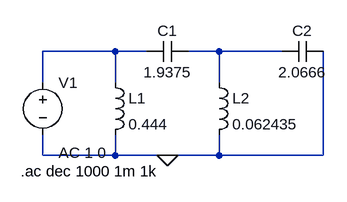
[diagram p0: schematic ej1_c.asc]
ej1_c.asc, the LTspice schematic file:
Version 4
SHEET 1 880 680
WIRE 128 64 16 64
WIRE 176 64 128 64
WIRE 288 64 240 64
WIRE 384 64 288 64
WIRE 16 112 16 64
WIRE 128 112 128 64
WIRE 288 112 288 64
WIRE 16 224 16 192
WIRE 128 224 128 192
WIRE 128 224 16 224
WIRE 208 224 128 224
WIRE 288 224 288 192
WIRE 288 224 208 224
WIRE 448 224 448 64
WIRE 448 224 288 224
FLAG 208 224 0
SYMBOL voltage 16 96 R0
WINDOW 123 24 124 Left 2
WINDOW 39 0 0 Left 0
SYMATTR InstName V1
SYMATTR Value ""
SYMATTR Value2 AC 1 0
SYMBOL ind 112 96 R0
SYMATTR InstName L1
SYMATTR Value 0.444
SYMBOL ind 272 96 R0
SYMATTR InstName L2
SYMATTR Value 0.062435
SYMBOL cap 240 48 R90
WINDOW 0 0 32 VBottom 2
WINDOW 3 32 32 VTop 2
SYMATTR InstName C1
SYMATTR Value 1.9375
SYMBOL cap 448 48 R90
WINDOW 0 0 32 VBottom 2
WINDOW 3 32 32 VTop 2
SYMATTR InstName C2
SYMATTR Value 2.0666
TEXT -18 248 Left 2 !.ac dec 1000 1m 1k

The netlist it stands for:
* ej1_c.asc
V1 N001 0 AC 1 0
L1 N001 0 0.444
L2 N002 0 0.062435
C1 N002 N001 1.9375
C2 0 N002 2.0666
.ac dec 1000 1m 1k
.backanno
.end